# Altium schematic sheet Slave_DA.SchDoc
size A3
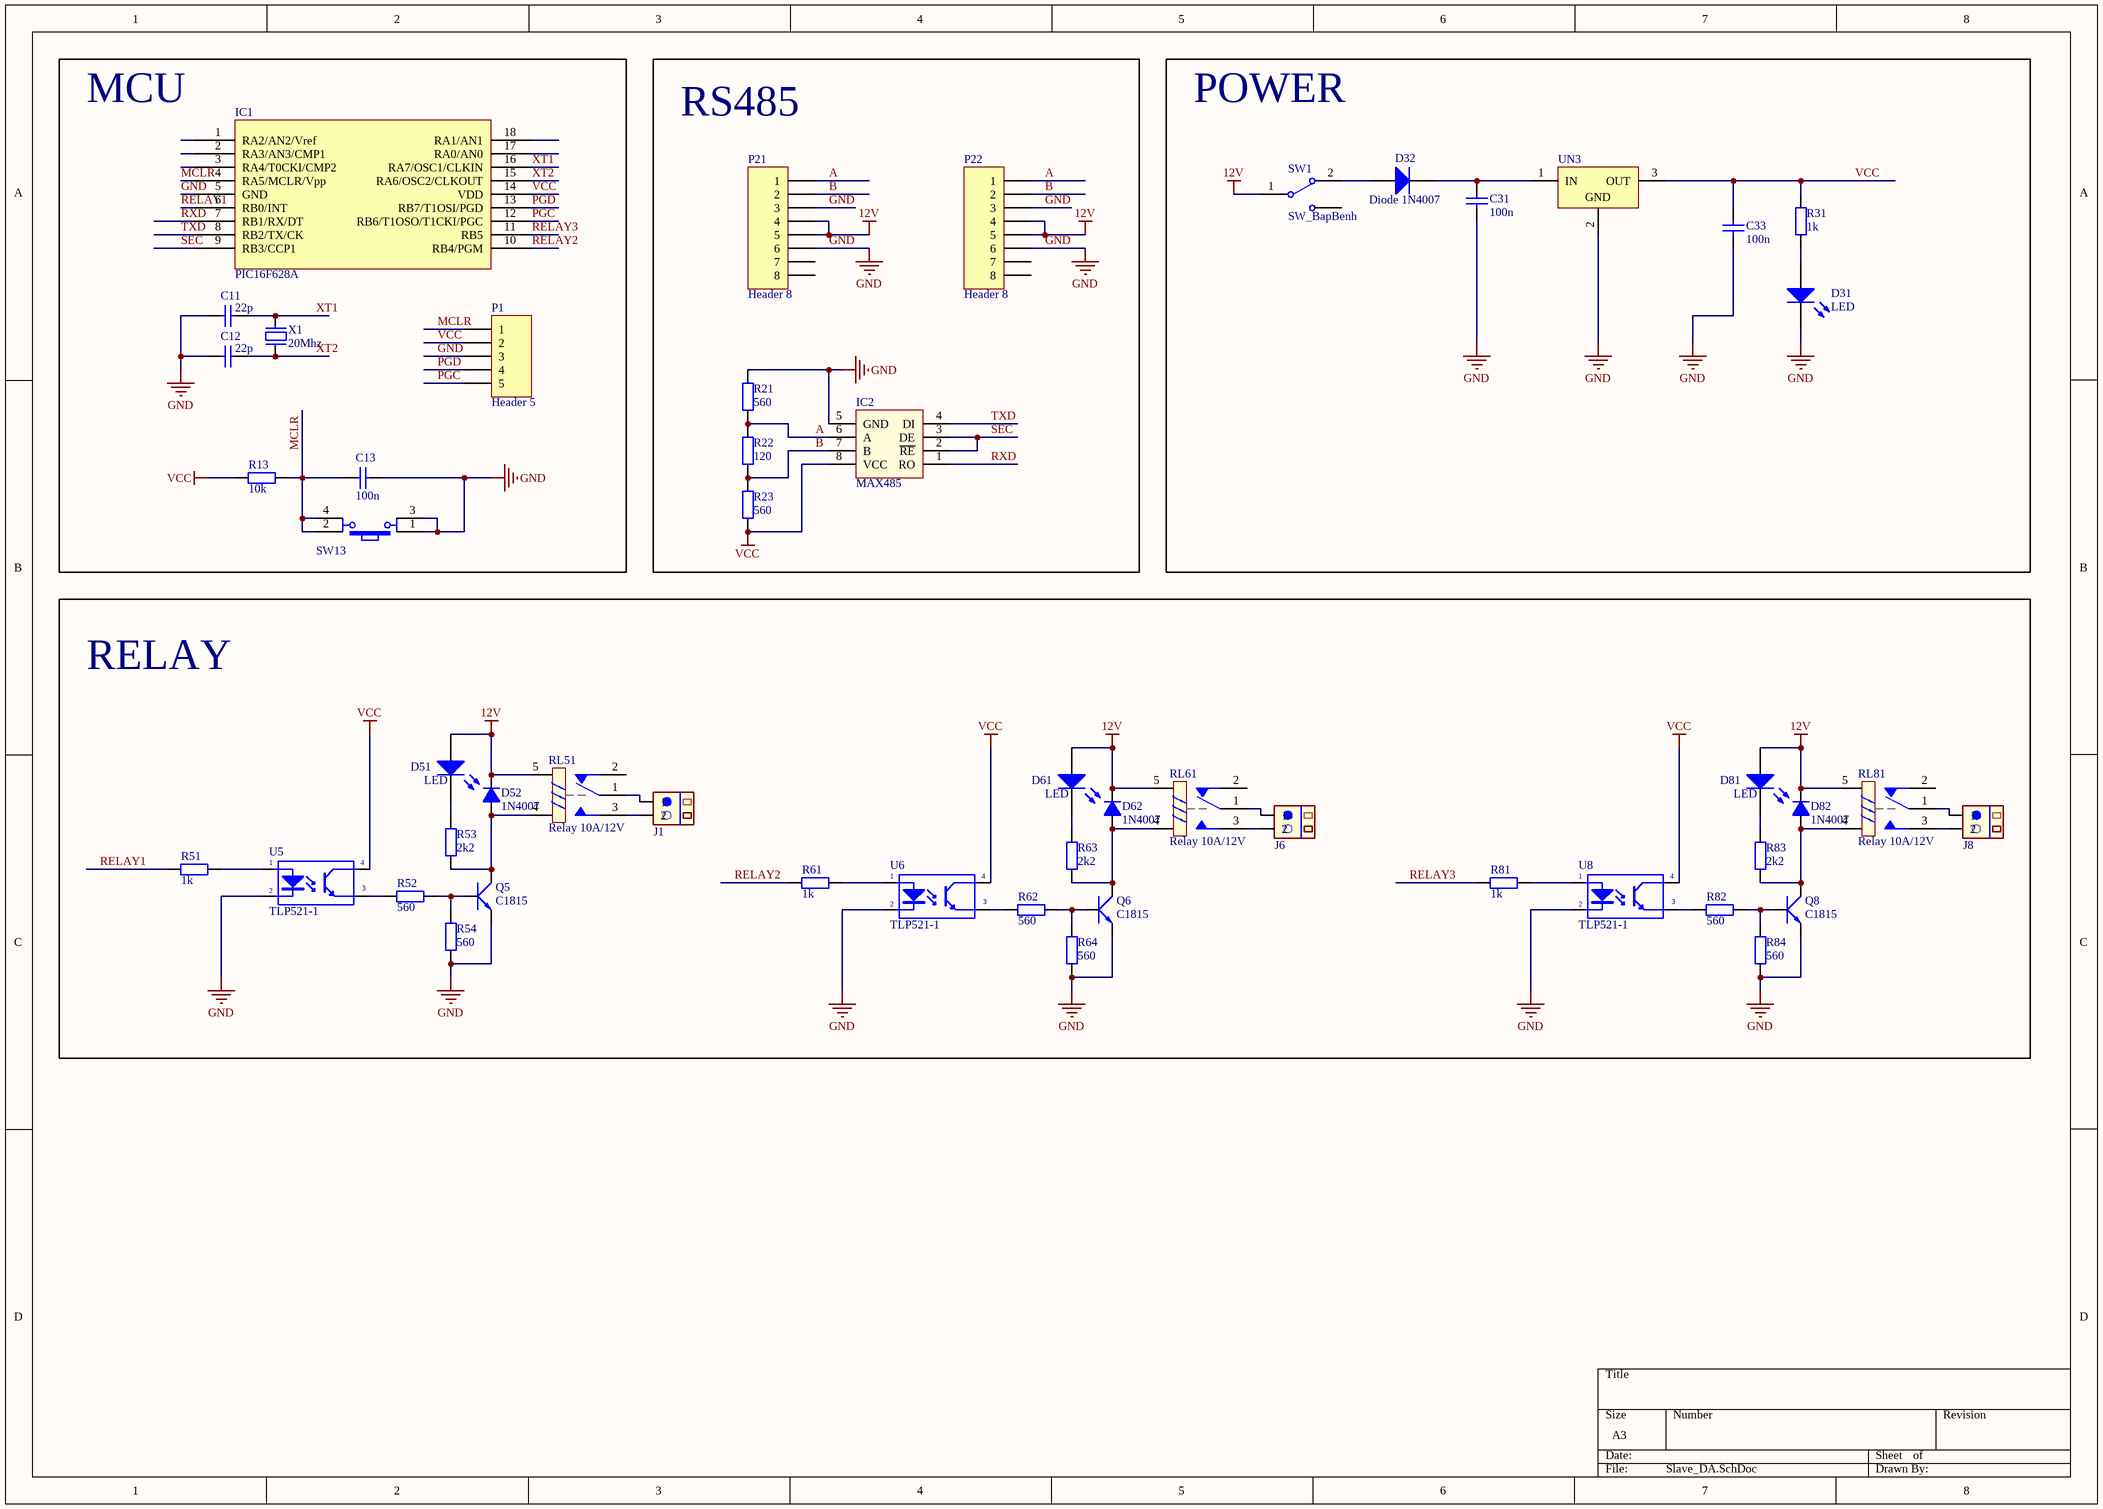
[diagram p0: Slave_DA.SchDoc]

## Parts
C11  value 22p  [C-NP-0805]  (hidden comment: Cap Non-pol)
C12  value 22p  [C-NP-0805]  (hidden comment: Cap Non-pol)
C13  value 100n  [CAP_SMD_0805]  (hidden comment: Capacitor Ceramic)
C31  value 100n  [C-NP-0805]  (hidden comment: Cap Non-pol)
C33  value 100n  [C-NP-0805]  (hidden comment: Cap Non-pol)
D31  LED  [LED-0805 RED]
D32  Diode 1N4007  [DO-41]
D51  LED  [LED-0 5mm RED]
D52  1N4007  [D1A]
D61  LED  [LED-0 5mm RED]
D62  1N4007  [D1A]
D81  LED  [LED-0 5mm RED]
D82  1N4007  [D1A]
IC1  PIC16F628A  [DIP18/W0.3]
IC2  MAX485  [DIP8/W0.3]
J1  CON.Domino2  [DOMINO 2B]  (value not drawn)
J6  CON.Domino2  [DOMINO 2B]  (value not drawn)
J8  CON.Domino2  [DOMINO 2B]  (value not drawn)
P1  Header 5  [Header 5]
P21  Header 8  [RJ11]
P22  Header 8  [RJ11]
Q5  C1815  [QTO-92]
Q6  C1815  [QTO-92]
Q8  C1815  [QTO-92]
R13  value 10k  [DIEN TRO 0805]  (hidden comment: RES_SMD_0805)
R21  value 560  [DIEN TRO 0805]  (hidden comment: RES_SMD_0805)
R22  value 120  [DIEN TRO 0805]  (hidden comment: RES_SMD_0805)
R23  value 560  [DIEN TRO 0805]  (hidden comment: RES_SMD_0805)
R31  value 1k  [DIEN TRO 0805]  (hidden comment: RES_SMD_0805)
R51  value 1k  [DIEN TRO 0805]  (hidden comment: RES_SMD_0805)
R52  value 560  [DIEN TRO 0805]  (hidden comment: RES_SMD_0805)
R53  value 2k2  [DIEN TRO 0805]  (hidden comment: RES_SMD_0805)
R54  value 560  [DIEN TRO 0805]  (hidden comment: RES_SMD_0805)
R61  value 1k  [DIEN TRO 0805]  (hidden comment: RES_SMD_0805)
R62  value 560  [DIEN TRO 0805]  (hidden comment: RES_SMD_0805)
R63  value 2k2  [DIEN TRO 0805]  (hidden comment: RES_SMD_0805)
R64  value 560  [DIEN TRO 0805]  (hidden comment: RES_SMD_0805)
R81  value 1k  [DIEN TRO 0805]  (hidden comment: RES_SMD_0805)
R82  value 560  [DIEN TRO 0805]  (hidden comment: RES_SMD_0805)
R83  value 2k2  [DIEN TRO 0805]  (hidden comment: RES_SMD_0805)
R84  value 560  [DIEN TRO 0805]  (hidden comment: RES_SMD_0805)
RL51  Relay 10A/12V  [RL_SPDT_10A]
RL61  Relay 10A/12V  [RL_SPDT_10A]
RL81  Relay 10A/12V  [RL_SPDT_10A]
SW1  SW_BapBenh  [SW_Bapbenh]
SW13  SW7  [SW4]  (value not drawn)
U5  TLP521-1  [DIP4/W0.3]
U6  TLP521-1  [DIP4/W0.3]
U8  TLP521-1  [DIP4/W0.3]
UN3  L78M05CP  [QTO-220]  (value not drawn)
X1  20Mhz  [XT2]

## Blocks framed on the sheet
MCU: C11-C13 IC1 P1 R13 SW13 X1
RS485: IC2 P21 P22 R21-R23
RELAY: D51 D52 D61 D62 D81 D82 J1 J6 J8 Q5 Q6 Q8 R51-R54 R61-R64 R81-R84 RL51 RL61 RL81 U5 U6 U8

## Nets
12V: D51.1(A) D52.2(K) D61.1(A) D62.2(K) D81.1(A) D82.2(K) P21.4 P21.5 P22.4 P22.5 RL51.5 RL61.5 RL81.5 SW1.1
GND: C11.2 C12.2 C13.1 C31.1 C33.1 D31.2(K) IC1.5(GND) IC2.5(GND) P1.3 P21.3 P21.6 P22.3 P22.6 Q5.1(E) Q6.1(E) Q8.1(E) R21.2 R54.2 R64.2 R84.2 SW13.1 SW13.3 U5.2(K) U6.2(K) U8.2(K) UN3.2(GND)
VCC: C33.2 IC1.14(VDD) IC2.8(VCC) P1.2 R13.2 R23.1 R31.2 U5.4(C) U6.4(C) U8.4(C) UN3.3(OUT)
A: IC2.6(A) P21.1 P22.1 R21.1 R22.2
B: IC2.7(B) P21.2 P22.2 R22.1 R23.2
MCLR: C13.2 IC1.4(RA5/MCLR/Vpp) P1.1 R13.1 SW13.2 SW13.4
PGC: IC1.12(RB6/T1OSO/T1CKI/PGC) P1.5
PGD: IC1.13(RB7/T1OSI/PGD) P1.4
RELAY1: IC1.6(RB0/INT) R51.2
RELAY2: IC1.10(RB4/PGM) R61.2
RELAY3: IC1.11(RB5) R81.2
RXD: IC1.7(RB1/RX/DT) IC2.1(RO)
SEC: IC1.9(RB3/CCP1) IC2.2(~{RE}) IC2.3(DE)
TXD: IC1.8(RB2/TX/CK) IC2.4(DI)
XT1: C11.1 IC1.16(RA7/OSC1/CLKIN) X1.2
XT2: C12.1 IC1.15(RA6/OSC2/CLKOUT) X1.1
NetC31_2: C31.2 D32.2(K) UN3.1(IN)
NetD31_1: D31.1(A) R31.1
NetD32_1: D32.1(A) SW1.2
NetD51_2: D51.2(K) R53.1
NetD52_1: D52.1(A) Q5.2(C) R53.2 RL51.4
NetD61_2: D61.2(K) R63.1
NetD62_1: D62.1(A) Q6.2(C) R63.2 RL61.4
NetD81_2: D81.2(K) R83.1
NetD82_1: D82.1(A) Q8.2(C) R83.2 RL81.4
NetJ1_1: J1.1 RL51.1
NetJ1_2: J1.2 RL51.3
NetJ6_1: J6.1 RL61.1
NetJ6_2: J6.2 RL61.3
NetJ8_1: J8.1 RL81.1
NetJ8_2: J8.2 RL81.3
NetQ5_3: Q5.3(B) R52.1 R54.1
NetQ6_3: Q6.3(B) R62.1 R64.1
NetQ8_3: Q8.3(B) R82.1 R84.1
NetR51_1: R51.1 U5.1(A)
NetR52_2: R52.2 U5.3(E)
NetR61_1: R61.1 U6.1(A)
NetR62_2: R62.2 U6.3(E)
NetR81_1: R81.1 U8.1(A)
NetR82_2: R82.2 U8.3(E)

Not connected (* = marked no-connect by the designer): IC1 1(RA2/AN2/Vref) 2(RA3/AN3/CMP1) 3(RA4/T0CKI/CMP2) 17(RA0/AN0) 18(RA1/AN1); P21 7 8; P22 7 8; RL51 2; RL61 2; RL81 2

## Notes on the sheet
- POWER

## Library data of the parts
C11 C12 C31 C33 = Cap Non-pol: Non-polarized Capacitor; Published: 8-Jun-2000; LatestRevisionDate: 17-Jul-2002; LatestRevisionNote: Re-released for DXP Platform.; PackageReference: RAD-0.3; Publisher: Altium Limited
C13 = CapSMD: Capacitor; Published: 8-Jun-2000; LatestRevisionDate: 17-Jul-2002; LatestRevisionNote: Re-released for DXP Platform.; PackageReference: RAD-0.3; Publisher: Altium Limited
D31 D51 D61 D81 = LED: Typical LED; Published: 8-Jun-2000; LatestRevisionDate: 08-Jul-2005; LatestRevisionNote: Mech Layer 1 removed.; PackageReference: LED-1; Publisher: Altium Limited
D32 = Diode 1N4007: 1 Amp General Purpose Rectifier; Published: 8-Jun-2000; LatestRevisionDate: 17-Jul-2002; LatestRevisionNote: Re-released for DXP Platform.; DatasheetVersion: 1998; PackageVersion: Aug-1999; PackageReference: DO-41; Publisher: Altium Limited; PackageDescription: Diode, Axial; Body 5.2 x 2.7 mm (LxDia. max), Lead Dia. 0.86 mm (max); Code_JEDEC: DO-204-AL; ComponentLink1Description: Manufacturer Link; ComponentLink1URL: http://www.fairchildsemi.com/; ComponentLink2Description: Datasheet; ComponentLink2URL: http://www.fairchildsemi.com/ds/1N%2F1N4001.pdf
D52 D62 D82 = D1A: Diode 1A; Value: 1N4007
IC2 = MAX485: RS232 - RS485 (Same sn75176)
J1 J6 J8 = CON.Domino2: 2 pins Domino Header; Publisher: Hoang Nguyen; ComponentLink1Description: Digikey Part link; ComponentLink2Description: Open DataSheet; ComponentLink2URL: H:\LIBRARY\LIBRARY.Datasheet\; Price: 2000VND
P1 = Header 5: Header, 5-Pin; LatestRevisionDate: 17-Jul-2002; LatestRevisionNote: Re-released for DXP Platform.; Publisher: Altium Limited
P21 P22 = Header 8: Header, 8-Pin; LatestRevisionDate: 17-Jul-2002; LatestRevisionNote: Re-released for DXP Platform.; Publisher: Altium Limited
Q5 Q6 Q8 = C1815: NPN 600mW, ECB; Value: C1815
R13 R21-R23 R31 R51-R54 R61-R64 R81-R84 = RES_SMD_0805: RES_0805; Published: 8-Jun-2000; LatestRevisionDate: 17-Jul-2002; LatestRevisionNote: Re-released for DXP Platform.; PackageReference: AXIAL-0.4; Publisher: Altium Limited
RL51 RL61 RL81 = Relay 1: Relay SPDT,10A - 12VDC 5 Pin; Value: Relay SPDT, 10A, 12V
SW13 = SW4: Switch button 4 pin; Value: Button chip 4 pin
U5 U6 U8 = TLP521-1: Single Opto; Value: TLP5211
UN3 = L78M05CP: Positive Voltage Regulator; Note: Tab is connected to pin 3 (GND).; Published: 24-Aug-2001; LatestRevisionDate: 17-Jul-2002; LatestRevisionNote: Re-released for DXP Platform.; DatasheetVersion: Apr-1994; PackageVersion: Jul-1998; PackageReference: ISOWATT220AB; Publisher: Altium Limited; PackageDescription: TO, Thru-Hole, Vertical, Heatsink Mounted; 3 In-Line Leads; Pitch 2.54 mm; Pin sequence 1, 3, 2; ComponentLink1Description: Manufacturer Link; ComponentLink1URL: http://www.st.com/; ComponentLink2Description: Datasheet; ComponentLink2URL: http://www.st.com/stonline/products/literature/ds/2146/l78m05c.pdf
X1 = XT2: Crystal For all Crystal 2pin.; Value: 4Mhz